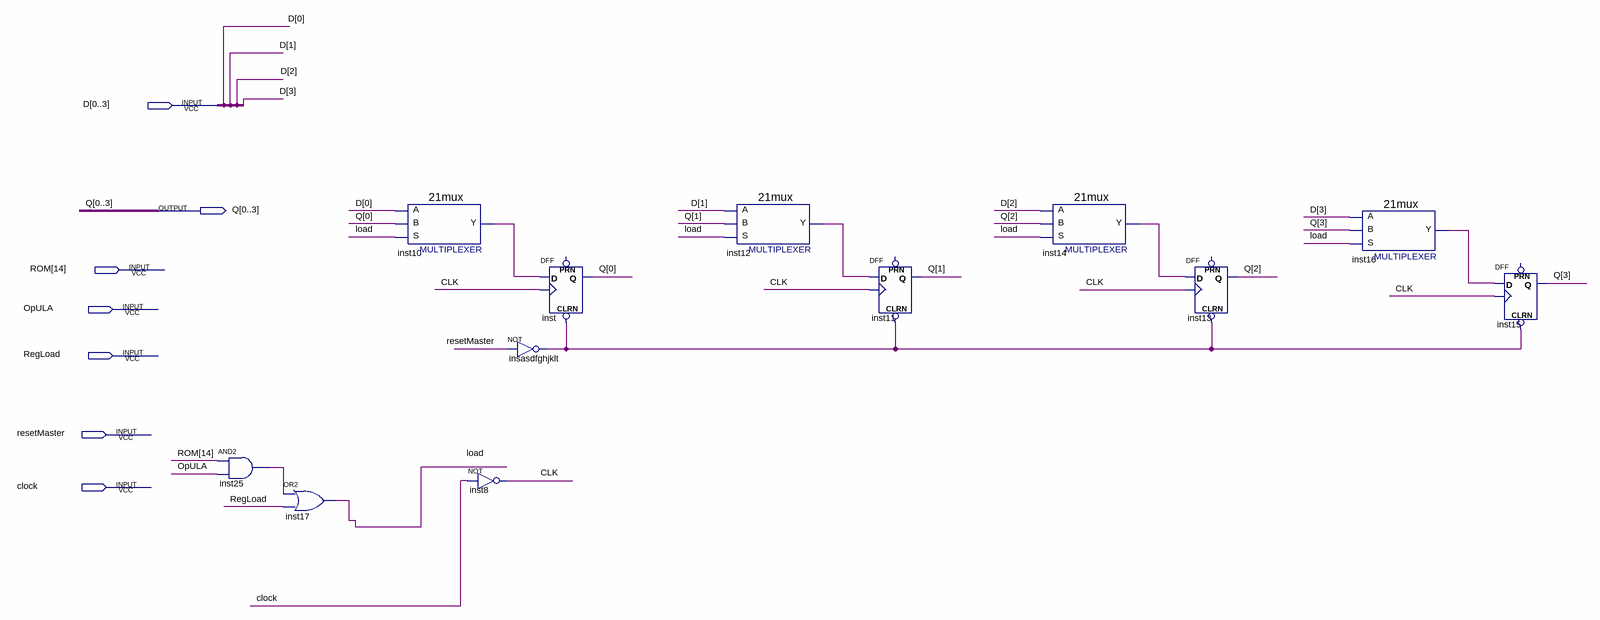
[diagram p0: schematic sheet]
// Quartus schematic Registrador.bdf as structural Verilog: 12 symbols, 7 pins
module Registrador (
  input  [0:3] D,
  input  [14:14] ROM,
  input  OpULA,
  input  RegLoad,
  input  resetMaster,
  input  clock,
  output [0:3] Q
);

  wire CLK, insasdfghjklt_out, inst10_y, inst12_y, inst14_y, inst16_y, inst25_out, load;

  and inst25 (inst25_out, ROM[14], OpULA);
  or inst17 (load, inst25_out, RegLoad);
  \21mux  inst10 (.S(load), .B(Q[0]), .A(D[0]), .Y(inst10_y));
  not insasdfghjklt (insasdfghjklt_out, resetMaster);
  not inst8 (CLK, clock);
  DFF inst (.CLRN(insasdfghjklt_out), .CLK(CLK), .D(inst10_y), .Q(Q[0]));  // open: PRN
  \21mux  inst12 (.S(load), .B(Q[1]), .A(D[1]), .Y(inst12_y));
  DFF inst11 (.CLRN(insasdfghjklt_out), .CLK(CLK), .D(inst12_y), .Q(Q[1]));  // open: PRN
  \21mux  inst14 (.S(load), .B(Q[2]), .A(D[2]), .Y(inst14_y));
  DFF inst13 (.CLRN(insasdfghjklt_out), .CLK(CLK), .D(inst14_y), .Q(Q[2]));  // open: PRN
  \21mux  inst16 (.S(load), .B(Q[3]), .A(D[3]), .Y(inst16_y));
  DFF inst15 (.CLRN(insasdfghjklt_out), .CLK(CLK), .D(inst16_y), .Q(Q[3]));  // open: PRN
endmodule
